# Altium schematic sheet Microcontroller.SchDoc
size A4; SheetNumber: 1; SheetTotal: 6
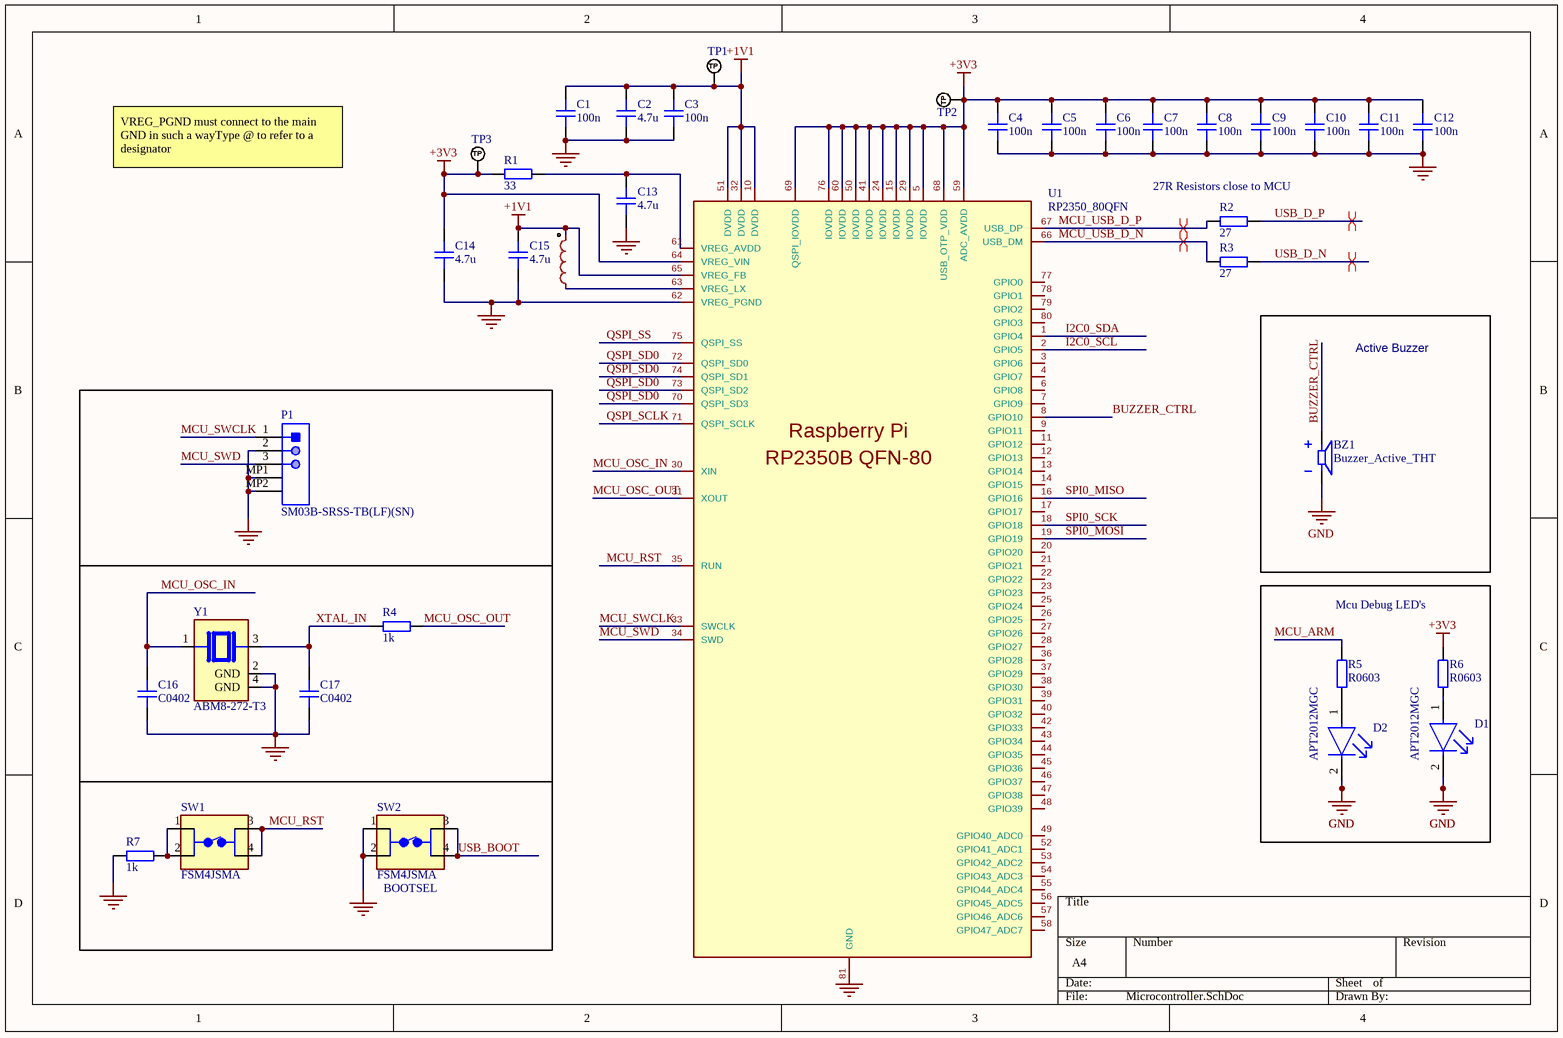
[diagram p0: Microcontroller.SchDoc]

## Parts
BZ1  Buzzer_Active_THT  [Buzzer_Active_Tht]
C1  100n  [CAP_0402]
C2  4.7u  [CAP_0402]
C3  100n  [CAP_0402]
C4  100n  [CAP_0402]
C5  100n  [CAP_0402]
C6  100n  [CAP_0402]
C7  100n  [CAP_0402]
C8  100n  [CAP_0402]
C9  100n  [CAP_0402]
C10  100n  [CAP_0402]
C11  100n  [CAP_0402]
C12  100n  [CAP_0402]
C13  4.7u  [CAP_0402]
C14  4.7u  [CAP_0402]
C15  4.7u  [CAP_0402]
C16  C0402  [CAP_0402]
C17  C0402  [CAP_0402]
D1  APT2012MGC  [FP-APT2012MGC-MFG]
D2  APT2012MGC  [FP-APT2012MGC-MFG]
L1  3.3uH  [IND-SMD_L2.0-W1.6_AOTA-B201610S3R3-101-T]  (value not drawn)
P1  SM03B-SRSS-TB(LF)(SN)  [JST-SM03B-SRSS-TB_V]
R1  33  [RES_0402]
R2  27  [RES_0402]
R3  27  [RES_0402]
R4  1k  [RES_0402]
R5  R0603  [RES_0603]
R6  R0603  [RES_0603]
R7  1k  [RES_0402]
SW1  FSM4JSMA  [TE_FSM4JSMA]
SW2  FSM4JSMA  [TE_FSM4JSMA]
TP1  TEST_POINT_RND_1MM  [PAD_RND_1MM]  (value not drawn)  (no BOM)
TP2  TEST_POINT_RND_1MM  [PAD_RND_1MM]  (value not drawn)  (no BOM)
TP3  TEST_POINT_RND_1MM  [PAD_RND_1MM]  (value not drawn)  (no BOM)
U1  RP2350_80QFN  [RP2350-QFN-80-1EP_10x10_P0.4mm_EP3.4x3.4mm_ThermalVias]
Y1  ABM8-272-T3  [XTAL_ABM8-272-T3]

## Blocks framed on the sheet
Active Buzzer: BZ1
BOOTSEL: C16 C17 P1 R4 R7 SW1 SW2 Y1
Mcu Debug LED's: D1 D2 R5 R6

## Nets
+1V1: C1.1 C2.1 C3.1 C15.1 L1.2 TP1.1(TP) U1.10(DVDD) U1.32(DVDD) U1.51(DVDD) U1.65(VREG_FB)
+3V3: C4.1 C5.1 C6.1 C7.1 C8.1 C9.1 C10.1 C11.1 C12.1 C14.1 R1.2 R6.2 TP2.1(TP) TP3.1(TP) U1.5(IOVDD) U1.15(IOVDD) U1.24(IOVDD) U1.29(IOVDD) U1.41(IOVDD) U1.50(IOVDD) U1.59(ADC_AVDD) U1.60(IOVDD) U1.64(VREG_VIN) U1.68(USB_OTP_VDD) U1.69(QSPI_IOVDD) U1.76(IOVDD)
GND: BZ1.N C1.2 C2.2 C3.2 C4.2 C5.2 C6.2 C7.2 C8.2 C9.2 C10.2 C11.2 C12.2 C13.2 C14.2 C15.2 C16.2 C17.2 D1.2(C) D2.2(C) P1.2 P1.MP1 P1.MP2 R7.2 SW2.1 SW2.2 U1.62(VREG_PGND) U1.81(GND) Y1.2(GND) Y1.4(GND)
BUZZER_CTRL: BZ1.P U1.8(GPIO10)
I2C0_SCL: U1.2(GPIO5)
I2C0_SDA: U1.1(GPIO4)
MCU_ARM: R5.2
MCU_OSC_IN: C16.1 U1.30(XIN) Y1.1
MCU_OSC_OUT: R4.1 U1.31(XOUT)
MCU_RST: SW1.3 SW1.4 U1.35(RUN)
MCU_SWCLK: P1.1 U1.33(SWCLK)
MCU_SWD: P1.3 U1.34(SWD)
MCU_USB_D_N: R3.2 U1.66(USB_DM)
MCU_USB_D_P: R2.2 U1.67(USB_DP)
QSPI_SCLK: U1.71(QSPI_SCLK)
QSPI_SD0: U1.70(QSPI_SD3) U1.72(QSPI_SD0) U1.73(QSPI_SD2) U1.74(QSPI_SD1)
QSPI_SS: U1.75(QSPI_SS)
SPI0_MISO: U1.16(GPIO16)
SPI0_MOSI: U1.19(GPIO19)
SPI0_SCK: U1.18(GPIO18)
USB_BOOT: SW2.3 SW2.4
USB_D_N: R3.1
USB_D_P: R2.1
XTAL_IN: C17.1 R4.2 Y1.3
NetC13_1: C13.1 R1.1 U1.61(VREG_AVDD)
NetD1_1: D1.1(A) R6.1
NetD2_1: D2.1(A) R5.1
NetL1_1: L1.1 U1.63(VREG_LX)
NetR7_1: R7.1 SW1.1 SW1.2

Not connected (* = marked no-connect by the designer): U1 3(GPIO6) 4(GPIO7) 6(GPIO8) 7(GPIO9) 9(GPIO11) 11(GPIO12) 12(GPIO13) 13(GPIO14) 14(GPIO15) 17(GPIO17) 20(GPIO20) 21(GPIO21) 22(GPIO22) 23(GPIO23) 25(GPIO24) 26(GPIO25) 27(GPIO26) 28(GPIO27) 36(GPIO28) 37(GPIO29) 38(GPIO30) 39(GPIO31) 40(GPIO32) 42(GPIO33) 43(GPIO34) 44(GPIO35) 45(GPIO36) 46(GPIO37) 47(GPIO38) 48(GPIO39) 49(GPIO40_ADC0) 52(GPIO41_ADC1) 53(GPIO42_ADC2) 54(GPIO43_ADC3) 55(GPIO44_ADC4) 56(GPIO45_ADC5) 57(GPIO46_ADC6) 58(GPIO47_ADC7) 77(GPIO0) 78(GPIO1) 79(GPIO2) 80(GPIO3)

## Layout directives
differential pair: MCU_USB_D_N, MCU_USB_D_P, USB_D_N, USB_D_P

## Notes on the sheet
- VREG_PGND must connect to the main GND in such a wayType @ to refer to a designator
- 27R Resistors close to MCU
- (in symbol RP2350_80QFN) Raspberry Pi; RP2350B QFN-80

## Library data of the parts
C1-C17 = CAP_0402: Capacitor SMD 0402; Manufacturer: *; Manufacturer Part Number: *; Distributor Link: *; LCSC: *; Rating: *; Dielectric: *
D1 D2 = CMP-44529-000017-1: LED GREEN CLEAR CHIP SMD; Power Rating: 75mW; Lens Color: Colorless; Luminous Intensity: 70mcd; Forward Current: 20mA; Dominant Wavelength: 570nm; Viewing Angle: 120°; Forward Voltage: 2.1V; Package Quantity: 2000; Color: Green; Length: 2mm; Lead Free: Lead Free; Min Operating Temperature: -40°C; Illumination Color: Green; Case/Package: 0805; Width: 1.25mm; Test Current: 20mA; Max Operating Temperature: 85°C; Case Code (Imperial): 0805; Mount: Surface Mount; Lens Style: Clear; Height: 0.75mm; Case Code (Metric): 2012; Packaging: Tape and Reel; Lens Transparency: Clear
L1 = AOTA-B201610S3R3-101-T: Manufacturer: ABRACON; Add into BOM: yes; Current Rating: 2.1A; Current - Saturation(Isat): 2.4A; DC Resistance(DCR): 115mΩ; Type: Molded Inductor; Symbol: AOTA-B201610S3R3-101-T; Device: AOTA-B201610S3R3-101-T; LCSC Part Name: 3.3uH 2.4A; Supplier Part: C42411119; Manufacturer Part: AOTA-B201610S3R3-101-T; Supplier Footprint: 0806; JLCPCB Part Class: Extended Part; Datasheet: https://item.szlcsc.com/datasheet/AOTA-B201610S3R3-101-T/44392932.html; Supplier: LCSC; Convert to PCB: yes; Value: 3.3uH
P1 = CMP-2000-07077-1: Male Header, Pitch 1 mm, 1 x 3 Position, Height 2.9 mm, -25 to 85 degC, RoHS, Tape and Reel; Manufacturer: JST; Pitch: 1mm; Style/Orientation: RightAngleHeader/Plug; No of Positions: 3; Package Description: Male Header, Pitch 1 mm, 1 x 3 Position, Height 2.9 mm; Manufacturer URL: http://www.jst.com/home2.html; Package Reference: SM03B-SRSS-TB; Type: ShroudedHeader; Termination: Crimp; Mounting Technology: SurfaceMount; Datasheet Version: 11/2010; Datasheet URL: https://datasheet.ciiva.com/26894/getdatasheetpartid-708885-26894671.pdf
R1-R4 R7 = RES_0402: Resistor SMD 0402; Manufacturer: *; Manufacturer Part Number: *; Distributor Link: *; LCSC: *
R5 R6 = RES_0603: Resistor SMD 0603; Manufacturer: *; Manufacturer Part Number: *; Distributor Link: *; LCSC: *
SW1 SW2 = FSM4JSMA: Tactile Switch SPST-NO Top Actuated Surface Mount; MF: TE Connectivity; MP: FSM-4J-SMA; SnapEDA_Link: https://www.snapeda.com/parts/FSM-4J-SMA/TE+Connectivity+ALCOSWITCH+Switches/view-part/?ref=snap; Package: None; Value: *; Check_prices: https://www.snapeda.com/parts/FSM-4J-SMA/TE+Connectivity+ALCOSWITCH+Switches/view-part/?ref=eda
TP1-TP3 = CMP-019-000001-1: Test Point Round 1mm (NO BOM); Design Item ID: TEST_POINT_RND_1MM; Source: Schematic-Lib-PhilsLab.SchLib
Y1 = ABM8-272-T3: 12 MHz Â±30ppm Crystal 10pF 50 Ohms 4-SMD, No Lead; MF: ABRACON; SnapEDA_Link: https://www.snapeda.com/parts/ABM8-272-T3/Abracon/view-part/?ref=snap; Package: NON-STANDARD-4 Abracon; Value: *; MP: ABM8-272-T3; Check_prices: https://www.snapeda.com/parts/ABM8-272-T3/Abracon/view-part/?ref=eda